# Altium schematic sheet Fonte +5.SchDoc: Fonte regulas + 5v
size A4; Date: 22/04/2023; ApprovedBy: Douglas Felipe; Author: Douglas Felipe; DocumentNumber: GERABS01; Revision: 1.0; SheetNumber: 2; SheetTotal: 5
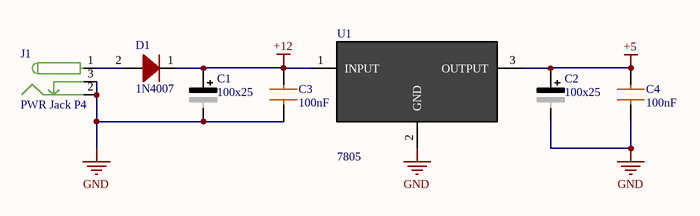
[diagram p0: Fonte +5.SchDoc]

## Parts
C1  100x25  [CAP 100X25 SMD]
C2  100x25  [CAP 100X25 SMD]
C3  100nF  [Capacitor 0805]
C4  100nF  [Capacitor 0805]
D1  1N4007  [SOD123]
J1  PWR Jack P4  [Jack P4 SMT]
U1  7805  [TO252-3]

## Nets
+5: C2.1(+) C4.2 U1.3(OUTPUT)
+12: C1.1(+) C3.2 D1.1 U1.1(INPUT)
GND: C1.2(-) C2.2(-) C3.1 C4.1 J1.2 J1.3 U1.2(GND)
NetD1_2: D1.2 J1.1

## Notes on the sheet
- PROJETO
- REV
- TITULO
- PÁG
- DE
- NÚMERO
- DESIGNER
- REVISADO POR
- DATA
- ARQUIVO
- TAMANHO
- A4

## Library data of the parts
C1 C2 = CAPACITOR ELETROLITICO: Polarized Capacitor (Radial); Published: 8-Jun-2000; LatestRevisionDate: 17-Jul-2002; LatestRevisionNote: Re-released for DXP Platform.; PackageReference: RB7.6-15; Publisher: Altium Limited; PackageDescription: Polarized Capacitor (Radial); 2 Leads
C3 C4 = CAPACITOR: Published: 8-Jun-2000; LatestRevisionDate: 17-Jul-2002; LatestRevisionNote: Re-released for DXP Platform.; PackageReference: RAD-0.3; Publisher: Altium Limited; PackageDescription: Radial Cap, Thru-Hole; 2 Leads; 0.3 in Pin Spacing
D1 = DIODO 1N4007: Diodo retificador de uso geral.; Published: 8-Jun-2000; LatestRevisionDate: 17-Jul-2002; LatestRevisionNote: Re-released for DXP Platform.; DatasheetVersion: 1997; PackageReference: DO-35; Publisher: Altium Limited; PackageDescription: Diode, Axial; Body 3.8 x 1.9 mm (LxDia. max), Lead Dia. 0.53 mm (max); Code_JEDEC: DO-204-AH; ComponentLink1Description: Manufacturer Link; ComponentLink1URL: http://www.fairchildsemi.com/; ComponentLink2Description: Datasheet; ComponentLink2URL: http://www.fairchildsemi.com/ds/1N%2F1N4148.pdf
J1 = PWR Jack P4: Connector Power PL 2 POS Solder RA Thru-Hole 3 Terminal 1 Port Bulk; Manufacturer: Switchcraft; Manufacturer Part Number: RAPC712X; Body Color: Black; Body Material: Thermoplastic; Number of Terminals/Pins: 3; Gender: Male; Shielding: Unshielded; Connector Type: Power,Jack; Current Rating: 5A; Insulation Resistance: 30MR; Number of Contacts: 2; Number of Ports: 1; Pin Diameter: 2.5mm; RoHS: Yes; Category: Connectors; Stock 1: 13399; Pricing 1: 1=1,91000, 10=1,33000, 50=1,33000, 100=1,23000, 1000=1,06000, 10000=1,04000 (USD); Mount: Through Hole,PCB,Panel; Number of Pins: 3; Contact Material: Brass; Contact Plating: Nickel,Silver; Housing Material: Thermoplastic; Color: Black; Housing Color: Black; Packaging: Bulk; Termination: Solder; Package Quantity: 2500; Orientation: Right Angle; Series: -; Contact Gender: Female; Max Current Rating: 5A; Primary Type: POWER; Length: 9mm; Depth: 14.5mm; Lead Free: Lead Free; Flammability Rating: UL94 V-0; RoHS Compliant: Yes; Reach SVHC Compliant: Yes; ComponentLink1URL: https://datasheet.ciiva.com/15173/getdatasheetpartid-110865-15173793.pdf?src-supplier=Verical; ComponentLink1Description: https://datasheet.ciiva.com/15173/getdatasheetpartid-110865-15173793.pdf?src-supplier=Verical; ComponentLink2URL: https://datasheet.ciiva.com/391/rapc712x-cd-391666.pdf?src-supplier=Digi-Key; ComponentLink2Description: https://datasheet.ciiva.com/391/rapc712x-cd-391666.pdf?src-supplier=Digi-Key; Supplier Part Number 1: 502-RAPC712X
U1 = L7805